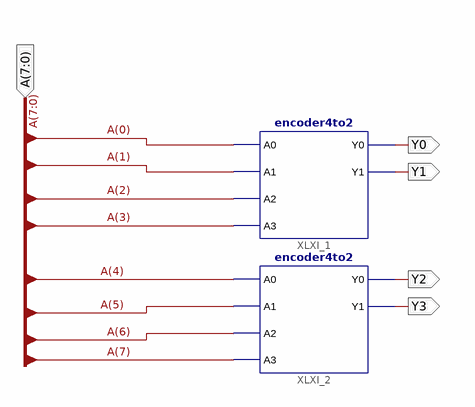
[diagram p0: schematic sheet 1]
// Xilinx ISE schematic encoder8to4.sch (spartan3e) as structural Verilog: 2 symbols, 5 ports
module encoder8to4 (
  input  [7:0] A,
  output Y0,
  output Y1,
  output Y2,
  output Y3
);

  encoder4to2 XLXI_1 (.A0(A[0]), .A1(A[1]), .A2(A[2]), .A3(A[3]), .Y0(Y0), .Y1(Y1));
  encoder4to2 XLXI_2 (.A0(A[4]), .A1(A[5]), .A2(A[6]), .A3(A[7]), .Y0(Y2), .Y1(Y3));
endmodule
